# EAGLE schematic Photon-GPS_schematic (EAGLE 8.4.3)
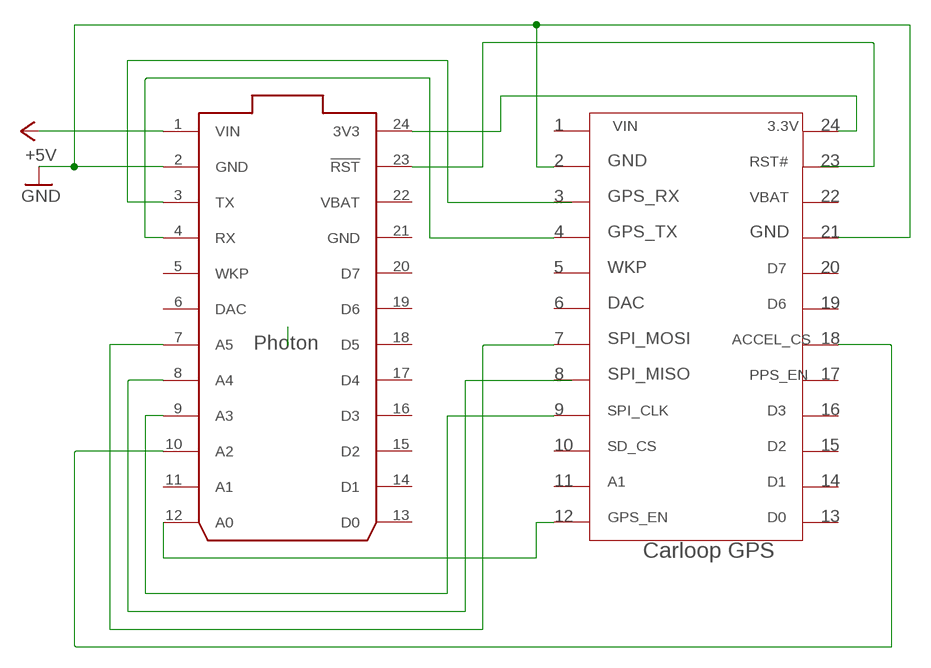
[diagram p0: schematic, sheet 1]

## Parts
U$1  PHOTON_WITH_HEADERS  [PHOTON]

## Nets
+5V: U$1.1(VIN)
GND: U$1.2(GND)
N$1: U$1.24(3V3)
N$3: U$1.4(RX)
N$4: U$1.3(TX)
N$5: U$1.7(A5)
N$6: U$1.23(!RST)
N$7: U$1.12(A0)
N$8: U$1.9(A3)
N$9: U$1.10(A2)
N$10: U$1.8(A4)
Unconnected: U$1.5(WKP) U$1.6(DAC) U$1.11(A1) U$1.13(D0) U$1.14(D1) U$1.15(D2) U$1.16(D3) U$1.17(D4) U$1.18(D5) U$1.19(D6) U$1.20(D7)

## Notes on the sheet
- 1 | VIN | 3.3V | 24
- 2 | GND | RST# | 23
- 3 | GPS_RX | VBAT | 22
- 4 | GPS_TX | GND | 21
- 5 | WKP | D7 | 20
- 6 | DAC | D6 | 19
- 7 | SPI_MOSI | ACCEL_CS | 18
- 8 | SPI_MISO | PPS_EN | 17
- 9 | SPI_CLK | D3 | 16
- 10 | SD_CS | D2 | 15
- 11 | A1 | D1 | 14
- 12 | GPS_EN | D0 | 13
- Carloop GPS

## Power pins joined to a net without a drawn wire
GND: U$1.21(GND)
VBAT: U$1.22(VBAT)

## Library data of the parts
U$1 = Particle-Devices:PHOTON: Particle Photon Wi-Fi through-hole development board footprint